# EAGLE design X100-7 (EAGLE 6.4)
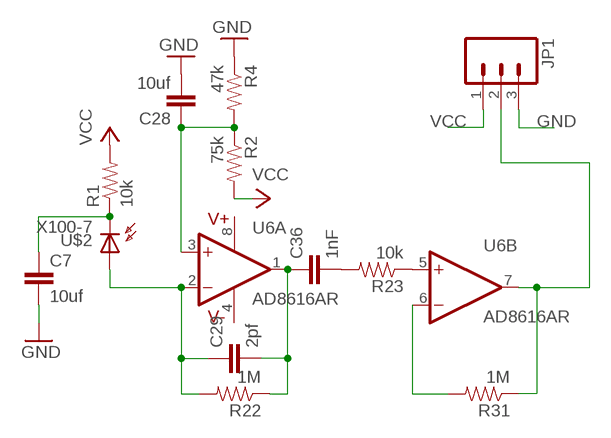
[diagram p0: schematic, sheet 1]

## Parts
C7  10uf  CAP1206  [1206]
C28  10uf  CAP1206  [1206]
C29  2pf  CAP1206  [1206]
C36  1nF  CAP1206  [1206]
JP1  M03PTH  [1X03]
R1  10k  RESISTOR1206  [1206]
R2  75k  RESISTOR1206  [1206]
R4  47k  RESISTOR1206  [1206]
R22  1M  RESISTOR1206  [1206]
R23  10k  RESISTOR1206  [1206]
R31  1M  RESISTOR1206  [1206]
U6  AD8616AR  [SOIC8]
U$2  X100-7  [CERPIN]

## Nets
GND: C7.2 C28.2 JP1.3 R4.1
N$1: C7.1 R1.1 U$2.2
N$2: C28.1 R2.1 R4.2 U6.3(A:+IN)
N$3: C29.1 R22.2 U6.2(A:-IN) U$2.1
N$5: C36.2 R23.2
N$7: R31.2 U6.6(B:-IN)
N$10: R23.1 U6.5(B:+IN)
N$11: C29.2 C36.1 R22.1 U6.1(A:OUT)
N$12: JP1.2 R31.1 U6.7(B:OUT)
VCC [power usb]: JP1.1 R1.2 R2.2

## Power pins joined to a net without a drawn wire
V+: U6.8(A:V+)
V-: U6.4(A:V-)

## Library data of the parts
C7 C28 C29 C36 = SparkFun-Capacitors:CAP: Capacitor Standard 0603 ceramic capacitor, and 0.1" leaded capacitor.
JP1 = SparkFun-Connectors:M03: Header 3 Standard 3-pin 0.1" header. Use with straight break away headers (SKU : PRT-00116), right angle break away headers (PRT-00553), swiss pins (PRT-00743), machine pins (PRT-00117), and female headers (PRT-00115). Molex polarized connector foot print use with SKU : PRT-08232 with associated crimp pins and housings.
R1 R2 R4 R22 R23 R31 = SparkFun-Resistors:RESISTOR: Resistor Basic schematic elements and footprints for 0603, 1206, and PTH resistors.
U6 = analog_devices_gaui:AD8616
U$2 = wrea:X100-7

## Net classes
3 power usb: width 0.508 mm, drill 0.406 mm, clearance 0.203 mm

## Board
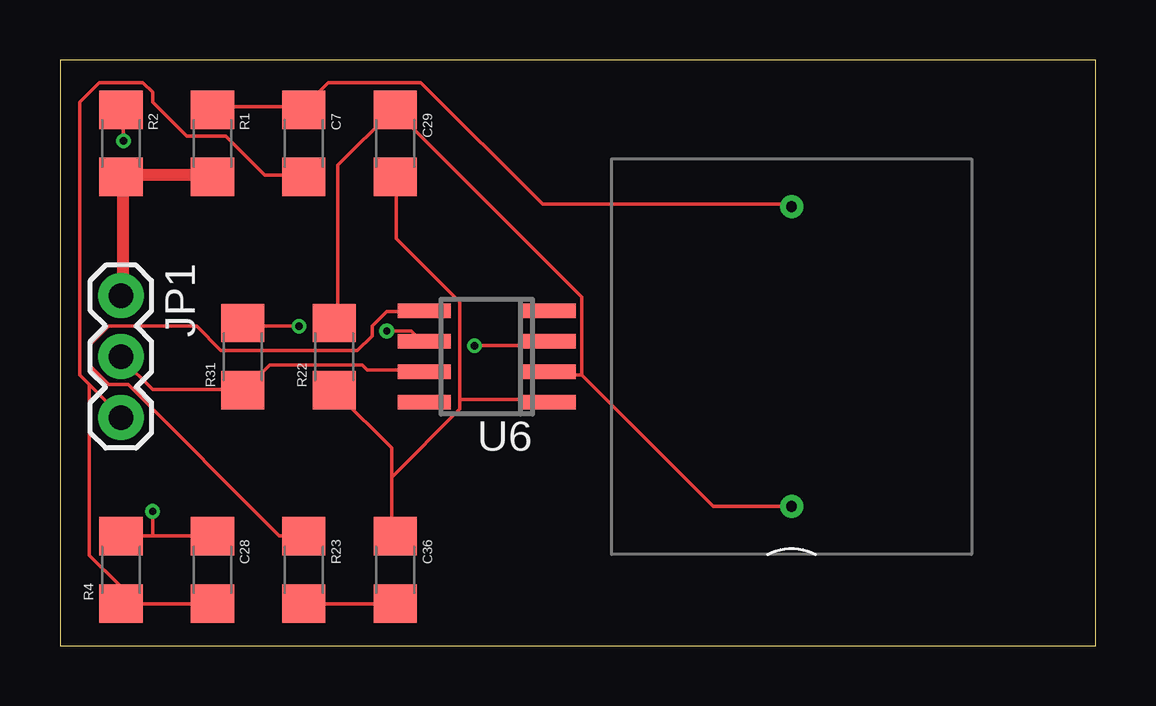
[diagram p1: board, top side]
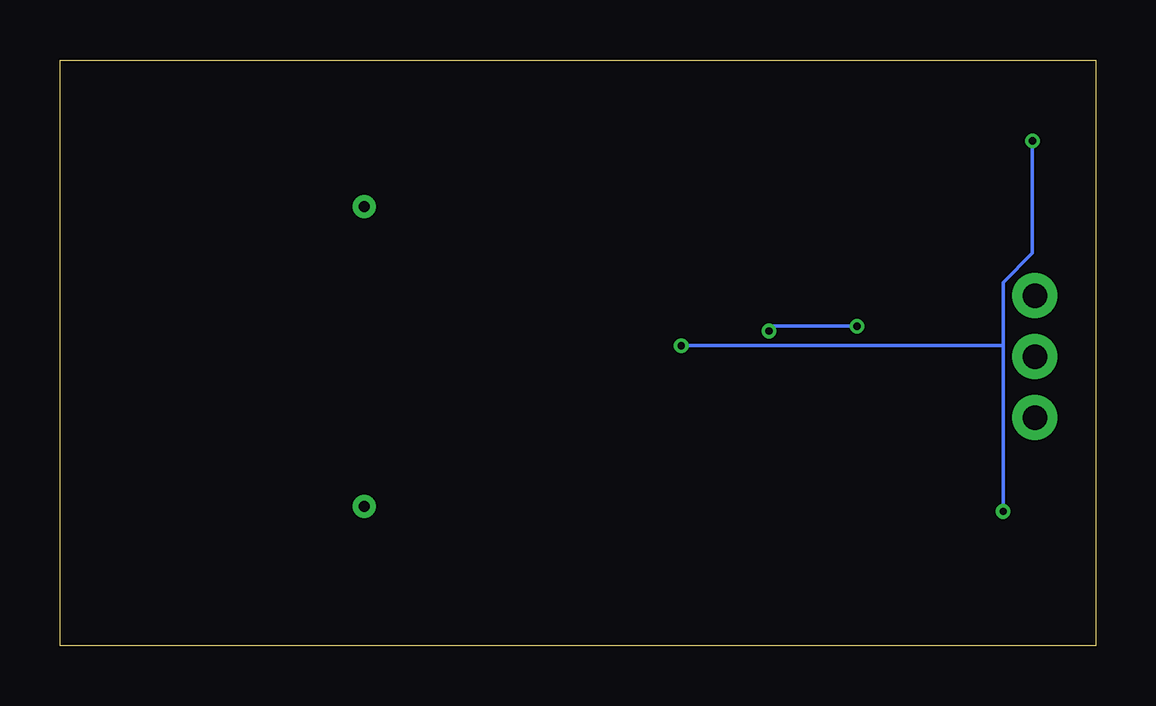
[diagram p2: board, bottom side, seen from below]

Size 43.16 x 24.43 mm. Coordinates in mm from the lower left corner, seen from the top.
Outline: 0,0 43.16,0 43.16,24.43 0,24.43 0,0
Copper layers (1*16): Top 0.035mm / dielectric 1.5mm / Bottom 0.035mm
Design rules "default": minimum track width 6mil, minimum drill 12mil, track to track 6mil, track to pad 6mil, pad to pad 6mil, via to via 6mil, smd to smd 0mil, copper to edge 10mil, drill to drill 10mil, minimum pad ring 10mil, minimum via ring 6mil, stop-mask expansion 2mil, vias tented up to drill 100mil, thermal gap 10mil

### Footprints (pad centres in the part's own frame; a part is rotated, then mirrored left to right if it is on the bottom)
1206 = smd 1.6 x 1.8: 1 -1.4,0; 2 1.4,0
1X03 = drill 1.016 pad 1.88: 1 0,0; 2 2.54,0; 3 5.08,0
SOIC8 = smd 0.6 x 2.2: 1 -1.905,-2.6; 2 -0.635,-2.6; 3 0.635,-2.6; 4 1.905,-2.6; 5 1.905,2.6; 6 0.635,2.6; 7 -0.635,2.6; 8 -1.905,2.6
CERPIN = drill 0.45: 1 -6.25,0; 2 6.25,0

### Placement (x,y rotation side)
C7  10.16,20.95 270 top
C28  6.35,3.17 270 top
C29  13.97,20.95 270 top
C36  13.97,3.17 270 top
JP1  2.54,14.61 270 top
R1  6.35,20.95 270 top
R2  2.54,20.95 270 top
R4  2.54,3.17 90 top
R22  11.43,12.06 90 top
R23  10.16,3.17 270 top
R31  7.62,12.06 90 top
U6  17.78,12.06 90 top
U$2  30.48,12.06 90 top

### Tracks (layer width: path | path; a pad name or v marks a point on that pad's centre or on a via)
GND
  Top 0.152: C28.2 6.3,1.75 2.64,1.75 R4.1 2.44,1.96 2.44,2.56 1.22,3.79 1.22,10.9 | 1.22,10.9 2.44,9.68 JP1.3 | 1.22,10.9 0.81,11.3 0.81,22.68 1.63,23.5 3.45,23.5 3.86,23.09 3.86,22.68 5.28,21.26 6.91,21.26 8.53,19.63 10.16,19.63 C7.2
N$1
  Top 0.152: 10.16,22.48 6.5,22.48 R1.1 | 10.16,22.48 C7.1 10.16,22.48 | 10.16,22.48 11.18,23.5 15.04,23.5 20.12,18.41 30.48,18.41 U$2.2
N$2  (via drill 0.3)
  Top 0.152: 3.86,4.6 6.3,4.6 C28.1 | 3.86,4.6 2.64,4.6 R4.2 | v2.64,21.06 2.64,22.28 R2.1 | 3.86,4.6 v3.86,5.61 | v17.27,12.52 20.32,12.52 U6.3
  Bottom 0.152: v2.64,21.06 2.64,16.38 3.86,15.16 3.86,12.52 | v3.86,5.61 3.86,12.52 | 3.86,12.52 v17.27,12.52
N$3
  Top 0.152: R22.2 11.58,13.54 11.58,20.04 13.82,22.28 C29.1 14.02,22.28 21.74,14.55 21.74,11.3 | 21.74,11.3 27.23,5.82 U$2.1 | 21.74,11.3 20.52,11.3 U6.2
N$5
  Top 0.152: R23.2 10.16,1.75 13.82,1.75 C36.2
N$7  (via drill 0.3)
  Top 0.152: v9.96,13.34 7.72,13.34 R31.2 | v13.61,13.13 14.63,13.13 15.04,12.72 U6.6
  Bottom 0.152: v9.96,13.34 13.41,13.34 v13.61,13.13
N$10
  Top 0.152: R23.1 10.16,4.6 9.14,4.6 2.85,10.9 2.03,10.9 1.22,11.71 1.22,12.52 2.03,13.34 5.69,13.34 6.71,12.32 12.39,12.32 13.01,12.93 13.01,13.34 13.61,13.95 15.04,13.95 U6.5
N$11
  Top 0.152: 13.82,7.04 13.82,8.26 11.58,10.49 R22.1 | 13.82,7.04 13.82,4.6 C36.1 | 16.66,10.29 16.66,9.88 13.82,7.04 | 16.66,10.29 16.66,14.35 14.02,16.99 14.02,19.43 C29.2 | 16.66,10.29 20.32,10.29 U6.1
N$12
  Top 0.152: JP1.2 2.64,11.91 3.86,10.69 7.52,10.69 R31.1 7.72,10.69 8.74,11.71 12.6,11.71 12.8,11.51 15.04,11.51 U6.7
VCC
  Top 0.508: R1.2 6.3,19.63 2.64,19.63 R2.2 2.64,19.43 2.64,14.76 JP1.1